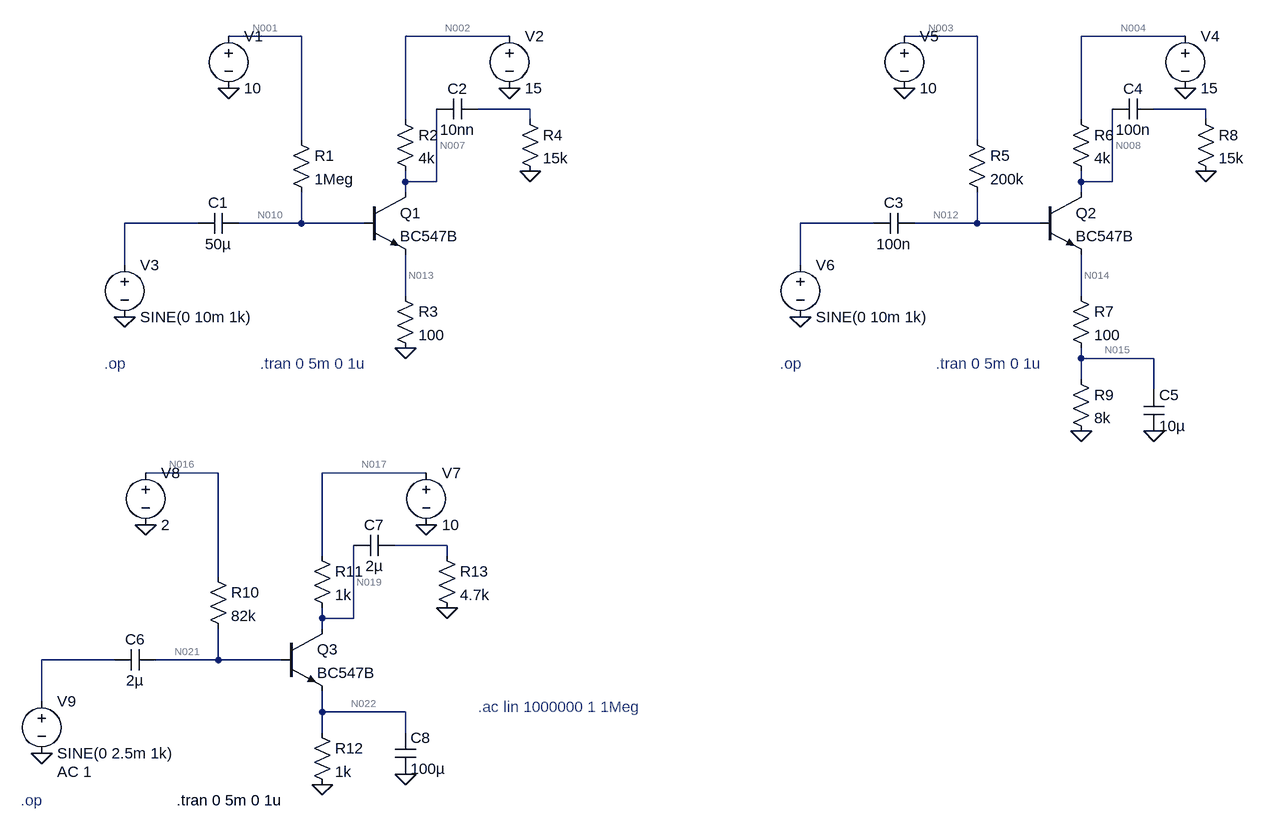
[diagram p0: schematic amplificador_super_magico.asc]
amplificador_super_magico.asc, the LTspice schematic file:
Version 4
SHEET 1 1524 1064
WIRE 64 -128 -48 -128
WIRE 384 -128 224 -128
WIRE 1104 -128 992 -128
WIRE 1424 -128 1264 -128
WIRE 416 -16 336 -16
WIRE 1456 -16 1376 -16
WIRE 224 0 224 -128
WIRE 416 0 416 -16
WIRE 1264 0 1264 -128
WIRE 1456 0 1456 -16
WIRE 64 32 64 -128
WIRE 1104 32 1104 -128
WIRE 224 96 224 80
WIRE 272 96 272 -16
WIRE 272 96 224 96
WIRE 1264 96 1264 80
WIRE 1312 96 1312 -16
WIRE 1312 96 1264 96
WIRE 224 112 224 96
WIRE 1264 112 1264 96
WIRE -96 160 -208 160
WIRE 64 160 64 112
WIRE 64 160 -32 160
WIRE 160 160 64 160
WIRE 944 160 832 160
WIRE 1104 160 1104 112
WIRE 1104 160 1008 160
WIRE 1200 160 1104 160
WIRE -208 224 -208 160
WIRE 832 224 832 160
WIRE 224 272 224 208
WIRE 1264 272 1264 208
WIRE 1264 368 1264 352
WIRE 1376 368 1264 368
WIRE 1264 400 1264 368
WIRE 1376 416 1376 368
WIRE -64 544 -176 544
WIRE 256 544 96 544
WIRE 288 656 208 656
WIRE 96 672 96 544
WIRE 288 672 288 656
WIRE -64 704 -64 544
WIRE 96 768 96 752
WIRE 144 768 144 656
WIRE 144 768 96 768
WIRE 96 784 96 768
WIRE -224 832 -336 832
WIRE -64 832 -64 784
WIRE -64 832 -160 832
WIRE 32 832 -64 832
WIRE -336 896 -336 832
WIRE 96 912 96 880
WIRE 224 912 96 912
WIRE 96 944 96 912
WIRE 224 944 224 912
FLAG 224 352 0
FLAG 384 -48 0
FLAG -48 -48 0
FLAG -208 304 0
FLAG 416 80 0
FLAG 1424 -48 0
FLAG 992 -48 0
FLAG 832 304 0
FLAG 1456 80 0
FLAG 1264 480 0
FLAG 1376 480 0
FLAG 96 1024 0
FLAG 256 624 0
FLAG -176 624 0
FLAG -336 976 0
FLAG 288 752 0
FLAG 224 1008 0
SYMBOL npn 160 112 R0
SYMATTR InstName Q1
SYMATTR Value BC547B
SYMBOL res 48 16 R0
SYMATTR InstName R1
SYMATTR Value 1Meg
SYMBOL res 208 -16 R0
SYMATTR InstName R2
SYMATTR Value 4k
SYMBOL res 208 256 R0
SYMATTR InstName R3
SYMATTR Value 100
SYMBOL voltage 384 -144 R0
WINDOW 123 0 0 Left 0
WINDOW 39 0 0 Left 0
SYMATTR InstName V2
SYMATTR Value 15
SYMBOL voltage -48 -144 R0
WINDOW 123 0 0 Left 0
WINDOW 39 0 0 Left 0
SYMATTR InstName V1
SYMATTR Value 10
SYMBOL voltage -208 208 R0
WINDOW 123 0 0 Left 0
WINDOW 39 0 0 Left 0
SYMATTR InstName V3
SYMATTR Value SINE(0 10m 1k)
SYMBOL cap -32 144 R90
WINDOW 0 0 32 VBottom 2
WINDOW 3 32 32 VTop 2
SYMATTR InstName C1
SYMATTR Value 50µ
SYMBOL res 400 -16 R0
SYMATTR InstName R4
SYMATTR Value 15k
SYMBOL cap 336 -32 R90
WINDOW 0 0 32 VBottom 2
WINDOW 3 32 32 VTop 2
SYMATTR InstName C2
SYMATTR Value 10nn
SYMBOL npn 1200 112 R0
SYMATTR InstName Q2
SYMATTR Value BC547B
SYMBOL res 1088 16 R0
SYMATTR InstName R5
SYMATTR Value 200k
SYMBOL res 1248 -16 R0
SYMATTR InstName R6
SYMATTR Value 4k
SYMBOL res 1248 256 R0
SYMATTR InstName R7
SYMATTR Value 100
SYMBOL voltage 1424 -144 R0
WINDOW 123 0 0 Left 0
WINDOW 39 0 0 Left 0
SYMATTR InstName V4
SYMATTR Value 15
SYMBOL voltage 992 -144 R0
WINDOW 123 0 0 Left 0
WINDOW 39 0 0 Left 0
SYMATTR InstName V5
SYMATTR Value 10
SYMBOL voltage 832 208 R0
WINDOW 123 0 0 Left 0
WINDOW 39 0 0 Left 0
SYMATTR InstName V6
SYMATTR Value SINE(0 10m 1k)
SYMBOL cap 1008 144 R90
WINDOW 0 0 32 VBottom 2
WINDOW 3 32 32 VTop 2
SYMATTR InstName C3
SYMATTR Value 100n
SYMBOL res 1440 -16 R0
SYMATTR InstName R8
SYMATTR Value 15k
SYMBOL cap 1376 -32 R90
WINDOW 0 0 32 VBottom 2
WINDOW 3 32 32 VTop 2
SYMATTR InstName C4
SYMATTR Value 100n
SYMBOL res 1248 384 R0
SYMATTR InstName R9
SYMATTR Value 8k
SYMBOL cap 1360 416 R0
SYMATTR InstName C5
SYMATTR Value 10µ
SYMBOL npn 32 784 R0
SYMATTR InstName Q3
SYMATTR Value BC547B
SYMBOL res -80 688 R0
SYMATTR InstName R10
SYMATTR Value 82k
SYMBOL res 80 656 R0
SYMATTR InstName R11
SYMATTR Value 1k
SYMBOL res 80 928 R0
SYMATTR InstName R12
SYMATTR Value 1k
SYMBOL voltage 256 528 R0
WINDOW 123 0 0 Left 0
WINDOW 39 0 0 Left 0
SYMATTR InstName V7
SYMATTR Value 10
SYMBOL voltage -176 528 R0
WINDOW 123 0 0 Left 0
WINDOW 39 0 0 Left 0
SYMATTR InstName V8
SYMATTR Value 2
SYMBOL voltage -336 880 R0
WINDOW 123 24 124 Left 2
WINDOW 39 0 0 Left 0
SYMATTR Value2 AC 1
SYMATTR InstName V9
SYMATTR Value SINE(0 2.5m 1k)
SYMBOL cap -160 816 R90
WINDOW 0 0 32 VBottom 2
WINDOW 3 32 32 VTop 2
SYMATTR InstName C6
SYMATTR Value 2µ
SYMBOL res 272 656 R0
SYMATTR InstName R13
SYMATTR Value 4.7k
SYMBOL cap 208 640 R90
WINDOW 0 0 32 VBottom 2
WINDOW 3 32 32 VTop 2
SYMATTR InstName C7
SYMATTR Value 2µ
SYMBOL cap 208 944 R0
SYMATTR InstName C8
SYMATTR Value 100µ
TEXT -240 376 Left 2 ;.op
TEXT 0 376 Left 2 ;.tran 0 5m 0 1u
TEXT 800 376 Left 2 ;.op
TEXT 1040 376 Left 2 ;.tran 0 5m 0 1u
TEXT -368 1048 Left 2 ;.op
TEXT -128 1048 Left 2 !.tran 0 5m 0 1u
TEXT 336 904 Left 2 ;.ac lin 1000000 1 1Meg

The netlist it stands for:
* amplificador_super_magico.asc
Q1 N007 N010 N013 0 BC547B
R1 N001 N010 1Meg
R2 N002 N007 4k
R3 N013 0 100
V2 N002 0 15
V1 N001 0 10
V3 N009 0 SINE(0 10m 1k)
C1 N010 N009 50µ
R4 N005 0 15k
C2 N005 N007 10nn
Q2 N008 N012 N014 0 BC547B
R5 N003 N012 200k
R6 N004 N008 4k
R7 N014 N015 100
V4 N004 0 15
V5 N003 0 10
V6 N011 0 SINE(0 10m 1k)
C3 N012 N011 100n
R8 N006 0 15k
C4 N006 N008 100n
R9 N015 0 8k
C5 N015 0 10µ
Q3 N019 N021 N022 0 BC547B
R10 N016 N021 82k
R11 N017 N019 1k
R12 N022 0 1k
V7 N017 0 10
V8 N016 0 2
V9 N020 0 SINE(0 2.5m 1k) AC 1
C6 N021 N020 2µ
R13 N018 0 4.7k
C7 N018 N019 2µ
C8 N022 0 100µ
.model NPN NPN
.model PNP PNP
.lib standard.bjt
* .op
* .tran 0 5m 0 1u
* .op
* .tran 0 5m 0 1u
* .op
.tran 0 5m 0 1u
* .ac lin 1000000 1 1Meg
.backanno
.end

* Results of the author's LTspice run, read from the files saved beside the schematic
* Operating Point, zero values left out:
*   V(n007) = 4.307 V
*   V(n010) = 932.6 mV
*   V(n013) = 268.2 mV
*   V(n001) = 10 V
*   V(n002) = 15 V
*   V(n008) = 10.76 V
*   V(n012) = 9.266 V
*   V(n014) = 8.626 V
*   V(n003) = 10 V
*   V(n004) = 15 V
*   V(n015) = 8.519 V
*   V(n019) = 8.941 V
*   V(n021) = 1.725 V
*   V(n022) = 1.062 V
*   V(n016) = 2 V
*   V(n017) = 10 V
*   Ic(Q1) = 2.673 mA
*   Ib(Q1) = 9.067 µA
*   Ie(Q1) = -2.682 mA
*   Ic(Q2) = 1.061 mA
*   Ib(Q2) = 3.671 µA
*   Ie(Q2) = -1.065 mA
*   Ic(Q3) = 1.059 mA
*   Ib(Q3) = 3.352 µA
*   Ie(Q3) = -1.062 mA
*   I(R1) = 9.067 µA
*   I(R2) = 2.673 mA
*   I(R3) = 2.682 mA
*   I(R5) = 3.671 µA
*   I(R6) = 1.061 mA
*   I(R7) = 1.065 mA
*   I(R9) = 1.065 mA
*   I(R10) = 3.352 µA
*   I(R11) = 1.059 mA
*   I(R12) = 1.062 mA
*   I(V2) = -2.673 mA
*   I(V1) = -9.067 µA
*   I(V4) = -1.061 mA
*   I(V5) = -3.671 µA
*   I(V7) = -1.059 mA
*   I(V8) = -3.352 µA